# EAGLE design pentalightHD_ctrl (EAGLE 5.11)
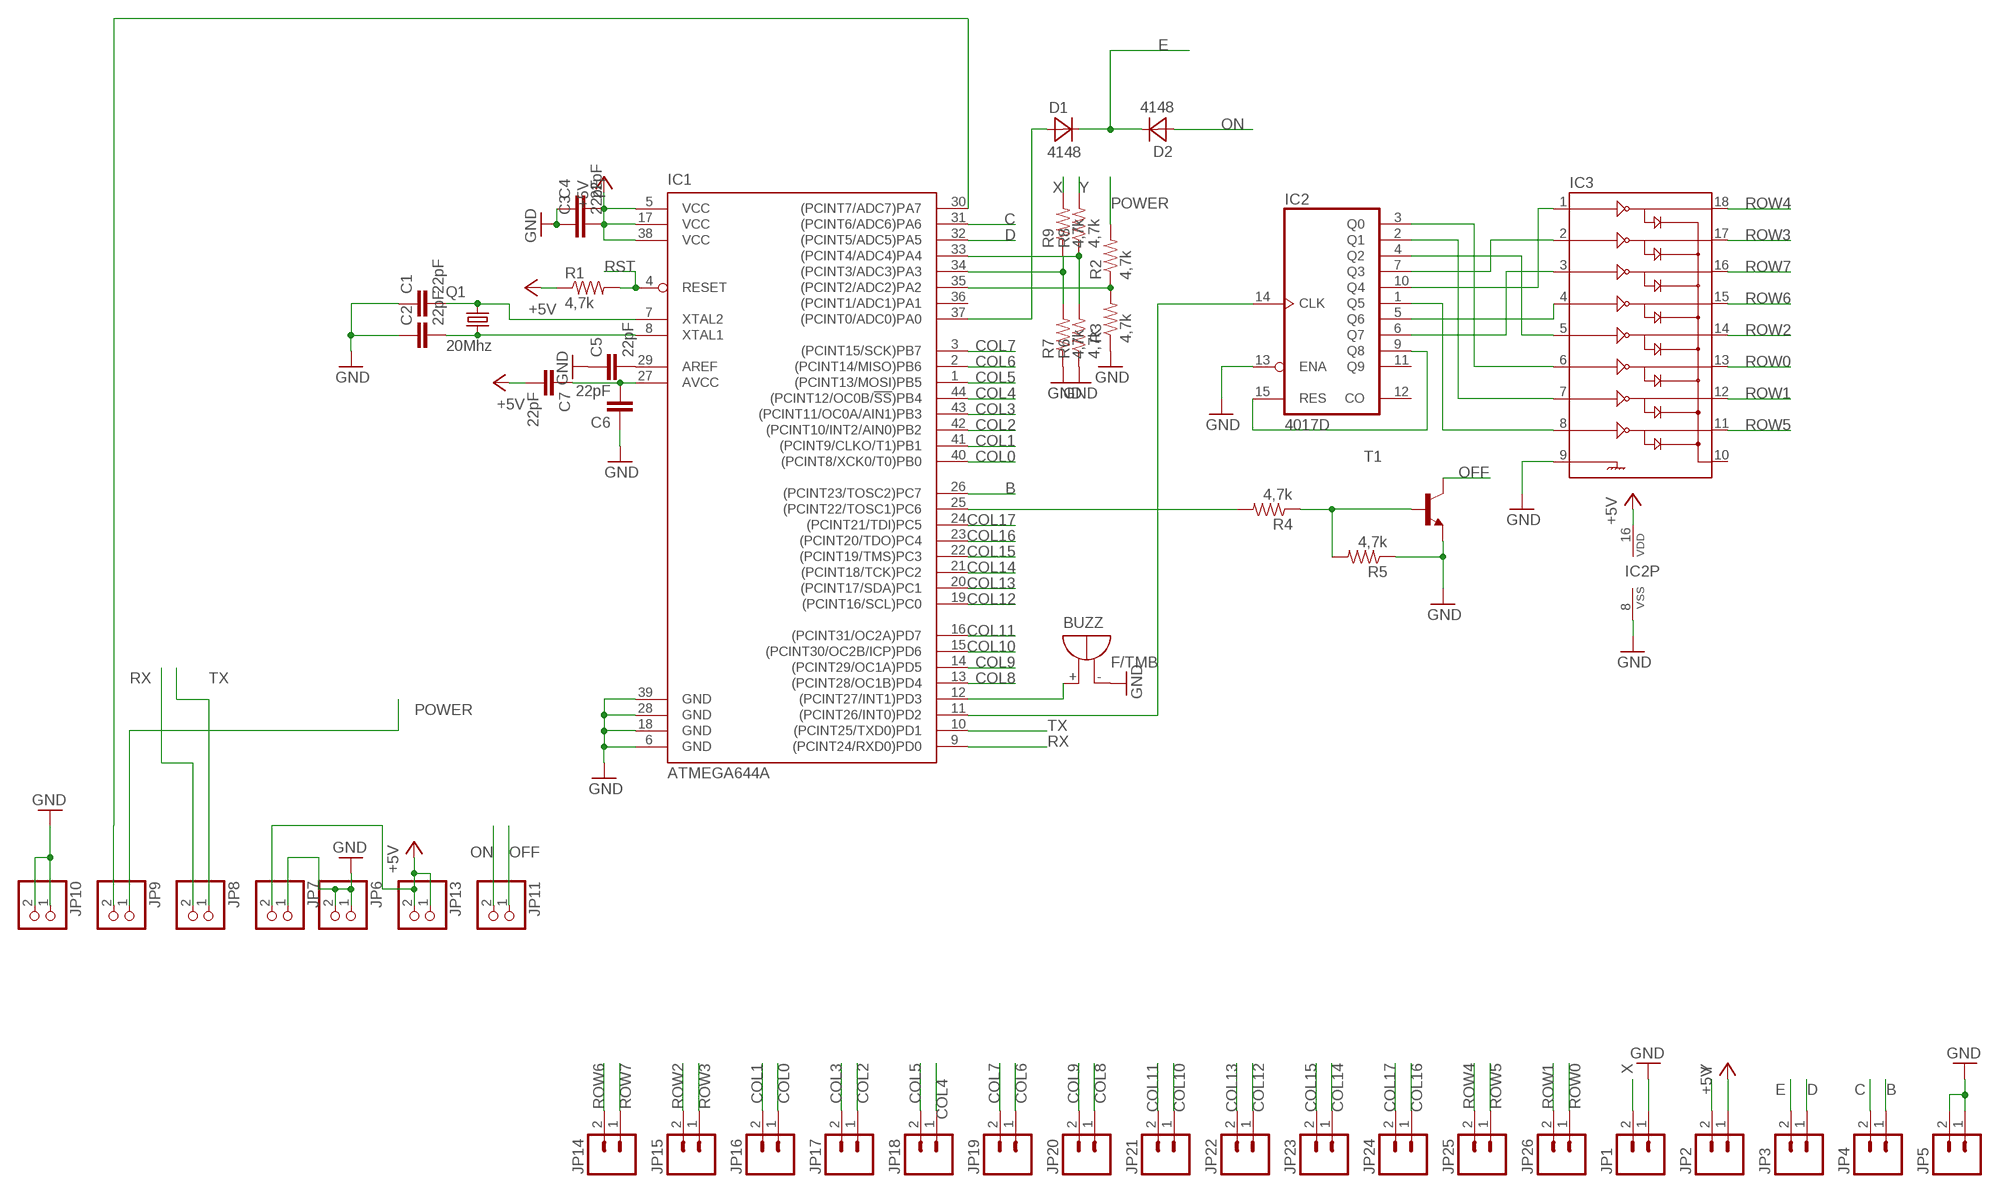
[diagram p0: schematic, sheet 1]

## Parts
BUZZ  F/TMB  [F/TMB]
C1  22pF  CAP0805  [0805]
C2  22pF  CAP0805  [0805]
C3  22pF  CAP0805  [0805]
C4  22pF  CAP0805  [0805]
C5  22pF  CAP0805  [0805]
C6  22pF  CAP0805  [0805]
C7  22pF  CAP0805  [0805]
D1  4148  DIODE_0805  [DIODE_0805]
D2  4148  DIODE_0805  [DIODE_0805]
IC1  ATMEGA644A  [TQFP44]
IC2  4017D  [SO16]
IC3  ULN2803SOIC  [SO018]
JP1  M02PTH  [1X02]
JP2  M02PTH  [1X02]
JP3  M02PTH  [1X02]
JP4  M02PTH  [1X02]
JP5  M02PTH  [1X02]
JP6  PINHD-1X02_2.54-SMD  [1X02SMD]
JP7  PINHD-1X02_2.54-SMD  [1X02SMD]
JP8  PINHD-1X02_2.54-SMD  [1X02SMD]
JP9  PINHD-1X02_2.54-SMD  [1X02SMD]
JP10  PINHD-1X02_2.54-SMD  [1X02SMD]
JP11  PINHD-1X02_2.54-SMD  [1X02SMD]
JP13  PINHD-1X02_2.54-SMD  [1X02SMD]
JP14  M02PTH  [1X02]
JP15  M02PTH  [1X02]
JP16  M02PTH  [1X02]
JP17  M02PTH  [1X02]
JP18  M02PTH  [1X02]
JP19  M02PTH  [1X02]
JP20  M02PTH  [1X02]
JP21  M02PTH  [1X02]
JP22  M02PTH  [1X02]
JP23  M02PTH  [1X02]
JP24  M02PTH  [1X02]
JP25  M02PTH  [1X02]
JP26  M02PTH  [1X02]
Q1  20Mhz  X22-OSCILLATOR  [X22]
R1  4,7k  RESISTOR  [0805]
R2  4,7k  RESISTOR  [0805]
R3  4,7k  RESISTOR  [0805]
R4  4,7k  RESISTOR  [0805]
R5  4,7k  RESISTOR  [0805]
R6  4,7k  RESISTOR  [0805]
R7  4,7k  RESISTOR  [0805]
R8  4,7k  RESISTOR  [0805]
R9  4,7k  RESISTOR  [0805]
T1  -NPN-SOT23-EBC  [SOT23-EBC]

## Nets
+5V: C3.2 C4.2 C7.2 IC1.5(VCC) IC1.17(VCC) IC1.38(VCC) IC2.16(VDD) JP2.1 JP7.2 JP13.1 JP13.2 R1.1
B: IC1.26((PCINT23/TOSC2)PC7) JP4.1
C: IC1.31((PCINT6/ADC6)PA6) JP4.2
COL0: IC1.40((PCINT8/XCK0/T0)PB0) JP16.1
COL1: IC1.41((PCINT9/CLKO/T1)PB1) JP16.2
COL2: IC1.42((PCINT10/INT2/AIN0)PB2) JP17.1
COL3: IC1.43((PCINT11/OC0A/AIN1)PB3) JP17.2
COL4: IC1.44((PCINT12/OC0B/!SS!)PB4) JP18.1
COL5: IC1.1((PCINT13/MOSI)PB5) JP18.2
COL6: IC1.2((PCINT14/MISO)PB6) JP19.1
COL7: IC1.3((PCINT15/SCK)PB7) JP19.2
COL8: IC1.13((PCINT28/OC1B)PD4) JP20.1
COL9: IC1.14((PCINT29/OC1A)PD5) JP20.2
COL10: IC1.15((PCINT30/OC2B/ICP)PD6) JP21.1
COL11: IC1.16((PCINT31/OC2A)PD7) JP21.2
COL12: IC1.19((PCINT16/SCL)PC0) JP22.1
COL13: IC1.20((PCINT17/SDA)PC1) JP22.2
COL14: IC1.21((PCINT18/TCK)PC2) JP23.1
COL15: IC1.22((PCINT19/TMS)PC3) JP23.2
COL16: IC1.23((PCINT20/TDO)PC4) JP24.1
COL17: IC1.24((PCINT21/TDI)PC5) JP24.2
D: IC1.32((PCINT5/ADC5)PA5) JP3.1
E: D1.1(C) D2.1(C) JP3.2
GND: BUZZ.- C1.1 C2.1 C3.1 C4.1 C5.1 C6.1 IC1.6(GND) IC1.18(GND) IC1.28(GND) IC1.39(GND) IC2.8(VSS) IC2.13(ENA) IC3.9 JP1.1 JP5.1 JP5.2 JP6.1 JP6.2 JP7.1 JP10.1 JP10.2 R3.1 R5.1 R6.1 R7.1 T1.E
N$1: D1.2(A) IC1.37((PCINT0/ADC0)PA0)
N$2: IC1.25((PCINT22/TOSC1)PC6) R4.2
N$3: C5.2 IC1.29(AREF)
N$4: IC1.30((PCINT7/ADC7)PA7) JP9.2
N$5: IC1.11((PCINT26/INT0)PD2) IC2.14(CLK)
N$6: IC2.9(Q8) IC2.15(RES)
N$7: C2.2 IC1.8(XTAL1) Q1.1
N$8: C1.2 IC1.7(XTAL2) Q1.3
N$9: C6.2 C7.1 IC1.27(AVCC)
N$10: R4.1 R5.2 T1.B
N$11: BUZZ.+ IC1.12((PCINT27/INT1)PD3)
N$14: IC1.33((PCINT4/ADC4)PA4) R6.2 R8.1
N$15: IC1.34((PCINT3/ADC3)PA3) R7.2 R9.1
N$28: IC1.35((PCINT2/ADC2)PA2) R2.1 R3.2
N$56: IC2.1(Q5) IC3.8
N$57: IC2.2(Q1) IC3.7
N$58: IC2.3(Q0) IC3.6
N$59: IC2.4(Q2) IC3.5
N$60: IC2.5(Q6) IC3.4
N$61: IC2.6(Q7) IC3.3
N$62: IC2.7(Q3) IC3.2
N$63: IC2.10(Q4) IC3.1
OFF: JP11.1 T1.C
ON: D2.2(A) JP11.2
POWER: JP9.1 R2.2
ROW0: IC3.13 JP26.1
ROW1: IC3.12 JP26.2
ROW2: IC3.14 JP15.2
ROW3: IC3.17 JP15.1
ROW4: IC3.18 JP25.2
ROW5: IC3.11 JP25.1
ROW6: IC3.15 JP14.2
ROW7: IC3.16 JP14.1
RST: IC1.4(RESET) R1.2
RX: IC1.9((PCINT24/RXD0)PD0) JP8.2
TX: IC1.10((PCINT25/TXD0)PD1) JP8.1
X: JP1.2 R9.2
Y: JP2.2 R8.2
Unconnected: IC1.36((PCINT1/ADC1)PA1) IC2.11(Q9) IC2.12(CO) IC3.10

## Library data of the parts
BUZZ = buzzer:F/TMB: BUZZER Source: Buerklin
C1-C7 = SparkFun:CAP: Capacitor Standard 0603 ceramic capacitor, and 0.1" leaded capacitor.
D1 D2 = seb:DIODE_0805
IC1 = atmel:ATMEGA644: 8-bit Microcontroller with 64K Bytes In-System Programmable Flash Source: http://www.atmel.com/dyn/resources/prod_documents/doc2593.pdf; MPN: ATMEGA644PV-10AU; OC_FARNELL: 1455123; OC_NEWARK: 58M3748
IC2 = 40xx:4017: COUNTER/DIVIDER
IC3 = SparkFun:ULN2803: Darlington Driver ULN2803 Darlington array. 500mA max per channel, 8-channel package. Spark Fun Electronics SKU : COM-00312
JP1-JP5 JP14-JP26 = SparkFun:M02: Header 2 Standard 2-pin 0.1" header. Use with straight break away headers (SKU : PRT-00116), right angle break away headers (PRT-00553), swiss pins (PRT-00743), machine pins (PRT-00117), and female headers (PRT-00115). Molex polarized connector foot print use with SKU : PRT-08233 with associated crimp pins and housings.
JP6-JP11 JP13 = pinhead-2:PINHD-1X02: PIN HEADER
Q1 = seb:X22-OSCILLATOR
R1-R9 = SparkFun:RESISTOR: Resistor Basic schematic elements and footprints for 0603, 1206, and PTH 1/10th watt (small) resistors.
T1 = transistor:*-NPN-: NPN Transistror BF959 corrected 2008.03.06

## Board
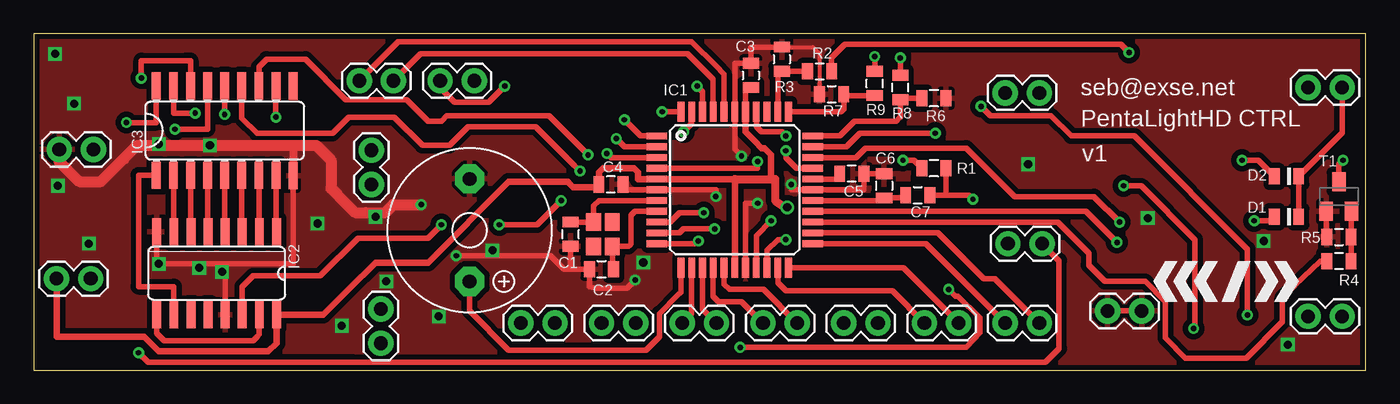
[diagram p1: board, top side]
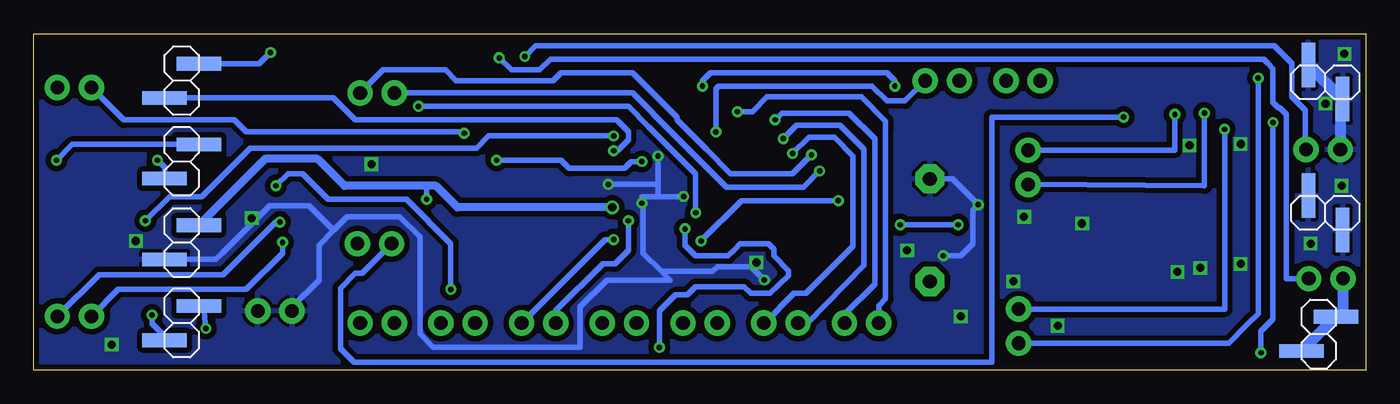
[diagram p2: board, bottom side, seen from below]

Size 99 x 25 mm. Coordinates in mm from the lower left corner, seen from the top.
Outline: 99,25 0,25 0,0 99,0 99,25
Copper layers (1+2*3+16): Top 0.035mm / dielectric 1.5mm / Route2 0.035mm / dielectric 0.15mm / Route3 0.035mm / dielectric 0.2mm / Bottom 0.035mm
Design rules "default *": minimum track width 10mil, minimum drill 0.4mm, track to track 8mil, track to pad 8mil, pad to pad 8mil, via to via 8mil, smd to smd 8mil, copper to edge 15mil, drill to drill 8mil, minimum pad ring 10mil, minimum via ring 8mil, stop-mask expansion 4mil, vias tented up to drill 190mil, thermal gap 10mil

### Footprints (pad centres in the part's own frame; a part is rotated, then mirrored left to right if it is on the bottom)
F/TMB = drill 1.016 pad 2.159 octagon: + 3.81,0; - -3.81,0
0805 = smd 0.8 x 1.2: 1 -0.9,0; 2 0.9,0
DIODE_0805 = smd 0.8 x 1.2: 1 -0.9,0; 2 0.9,0
TQFP44 = smd 1.5 x 0.5: 1 -5.8,4; 2 -5.8,3.2; 3 -5.8,2.4; 4 -5.8,1.6; 5 -5.8,0.8; 6 -5.8,0; 7 -5.8,-0.8; 8 -5.8,-1.6; 9 -5.8,-2.4; 10 -5.8,-3.2; 11 -5.8,-4; 23 5.8,-4; 24 5.8,-3.2; 25 5.8,-2.4; 26 5.8,-1.6; 27 5.8,-0.8; 28 5.8,0; 29 5.8,0.8; 30 5.8,1.6; 31 5.8,2.4; 32 5.8,3.2; 33 5.8,4 | smd 0.5 x 1.5: 12 -4,-5.8; 13 -3.2,-5.8; 14 -2.4,-5.8; 15 -1.6,-5.8; 16 -0.8,-5.8; 17 0,-5.8; 18 0.8,-5.8; 19 1.6,-5.8; 20 2.4,-5.8; 21 3.2,-5.8; 22 4,-5.8; 34 4,5.8; 35 3.2,5.8; 36 2.4,5.8; 37 1.6,5.8; 38 0.8,5.8; 39 0,5.8; 40 -0.8,5.8; 41 -1.6,5.8; 42 -2.4,5.8; 43 -3.2,5.8; 44 -4,5.8
SO16 = smd 0.66 x 2.032: 1 -4.445,-3.073; 2 -3.175,-3.073; 3 -1.905,-3.073; 4 -0.635,-3.073; 5 0.635,-3.073; 6 1.905,-3.073; 7 3.175,-3.073; 8 4.445,-3.073; 9 4.445,3.073; 10 3.175,3.073; 11 1.905,3.073; 12 0.635,3.073; 13 -0.635,3.073; 14 -1.905,3.073; 15 -3.175,3.073; 16 -4.445,3.073
SO018 = smd 0.66 x 2.032: 1 -5.08,-3.315; 2 -3.81,-3.315; 3 -2.54,-3.315; 4 -1.27,-3.315; 5 0,-3.315; 6 1.27,-3.315; 7 2.54,-3.315; 8 3.81,-3.315; 9 5.08,-3.353; 10 5.08,3.315; 11 3.81,3.315; 12 2.54,3.315; 13 1.27,3.315; 14 0,3.315; 15 -1.27,3.315; 16 -2.54,3.315; 17 -3.81,3.315; 18 -5.08,3.315
1X02 = drill 1.016 pad 1.88 round: 1 0,0; 2 2.54,0
1X02SMD = smd 1.016 x 3.302: 1 -1.27,1.27; 2 1.27,-1.27
X22 = smd 1.3 x 1.1: 1 0.9,0.7; 2 -0.9,0.7; 3 -0.9,-0.7; 4 0.9,-0.7
SOT23-EBC = smd 1 x 1.4: B 0.95,-1.1; C 0,1.1; E -0.95,-1.1

### Placement (x,y rotation side)
BUZZ  32.4,10.4 270 top
C1  39.9,10.1 90 top
C2  42.2,7.5 0 top
C3  53.3,21.9 270 top
C4  42.9,13.8 180 top
C5  60.8,14.6 180 top
C6  63.2,13.7 270 top
C7  65.7,13 0 top
D1  93.1,11.4 180 top
D2  93.1,14.4 180 top
IC1  52.1,13.4 0 top
IC2  13.6,7.2 180 top
IC3  14.2,17.8 0 top
JP1  1.9,16.4 0 top
JP2  1.7,6.8 0 top
JP3  94.7,21 0 top
JP4  94.7,4 0 top
JP5  79.8,4.4 0 top
JP6  3,21.4 180 bottom
JP7  88,9.5 90 bottom
JP8  88,3.5 270 bottom
JP9  88,21.5 270 bottom
JP10  3,11.7 180 bottom
JP11  88,15.5 270 bottom
JP13  3.5,2.7 90 bottom
JP14  25.8,2 90 top
JP15  25.1,13.8 90 top
JP16  24.2,21.5 0 top
JP17  30.2,21.5 0 top
JP18  36.2,3.5 0 top
JP19  42.2,3.5 0 top
JP20  48.2,3.5 0 top
JP21  54.2,3.5 0 top
JP22  60.2,3.5 0 top
JP23  66.2,3.5 0 top
JP24  72.2,3.5 0 top
JP25  72.4,9.4 0 top
JP26  72.2,20.6 0 top
Q1  42.3,10.1 270 top
R1  66.9,15 180 top
R2  58.4,22.2 0 top
R3  55.6,23.1 270 top
R4  97,8.1 180 top
R5  97,9.9 0 top
R6  66.9,20.2 180 top
R7  59.3,20.5 0 top
R8  64.4,21 90 top
R9  62.5,21.3 90 top
T1  97,12.9 0 top

### Tracks (layer width: path | path; a pad name or v marks a point on that pad's centre or on a via)
+5V  (via drill 0.4, 0.6)
  Top 0.406: 54.8,14.2 55.1,14.2 | 67.8,13 C7.2 | 67.8,13 67.8,13.6 R1.1 | 55.8,12.1 v56,12.1 | 42,13.6 C4.2 | v69.8,12.7 69.5,13 67.8,13 | IC1.38 52.9,21 C3.2
  Top 0.5: IC1.17 52.1,14.2 IC1.5 44.9,14.2 44.9,14.7 44.6,15 42.3,15 42,14.7 C4.2 | IC1.38 52.9,17.9 52.9,17.7 53.6,17 54.1,16.5 54.3,16.5 54.8,16 54.8,14.8 54.8,14.2 | JP2.1 1.7,2.5 8.2,2.5 9.3,1.4 17.45,1.4 18.05,2 IC2.16 21.53,4.13 23.4,6 25.4,8 29.3,8 35.3,14 39.7,14 39.8,13.9 40.1,13.6 42,13.6
  Top 0.61: 52.1,14.2 54.8,14.2 | 54.8,14.2 55.1,14.2 | 54.8,14.2 55.1,14.2 | 55.1,14.2 55.1,12.6 55.8,12.1
  Bottom 0.406: 1.7,4.3 JP13.2 | 69.1,13.7 69.8,13.7 v69.8,12.7
  Bottom 0.61: v56,12.1 67.5,12.1 69.1,13.7 69.8,13.7 75.9,13.7 77.9,15.7 81.8,15.7 82.73,14.77 JP7.2
  Bottom 0.813: JP13.2 JP13.1 | JP2.1 1.7,4.3
B  (via drill 0.4)
  Top 0.406: IC1.26 78.2,11.8 v80.5,9.5
  Bottom 0.406: v80.5,9.5 80.5,8.7 83.2,6 83.6,6 85.6,6 92.7,6 JP4.1
C  (via drill 0.4)
  Top 0.406: IC1.31 61.1,15.8 61.8,16.5 69.3,16.5 72.9,12.9 78.8,12.9 v80.7,11
  Bottom 0.406: v80.7,11 81,11 82.6,9.4 | 82.6,9.4 82.8,9.2 82.6,9.4 | 82.6,9.4 84.9,7.1 86.6,7.1 90.4,7.1 92,7.1 94.14,7.1 JP4.2
COL0
  Top 0.406: JP16.1 27.1,24.4 32,24.4 48.9,24.4 50.7,22.6 51.3,22 IC1.40
COL1
  Top 0.406: JP16.2 28.74,23.5 33.9,23.5 48.6,23.5 49.7,22.4 50.5,21.6 IC1.41
COL2  (via drill 0.4)
  Top 0.406: v35,21.1 33.8,19.9 31.3,19.9 30.2,21 JP17.1 | v49.3,21.1 49.7,20.7 IC1.42
  Bottom 0.406: v49.3,21.1 49.3,21.5 48.7,22.1 35.6,22.1 35,21.5 v35,21.1
COL3  (via drill 0.4)
  Top 0.406: v48.3,17.7 48.9,18.3 IC1.43
  Bottom 0.406: v48.3,17.7 48.3,19.7 48.3,20.9 48.1,21.1 47.6,21.1 45.8,21.1 45.4,21.1 36.7,21.1 35.6,20 34.24,20 JP17.2
COL4  (via drill 0.4)
  Top 0.406: v46.7,19.2 IC1.44
  Bottom 0.406: v46.7,19.2 45.6,19.2 44.5,20.3 37.5,20.3 35.7,18.5 35.7,17.9 35.7,5.3 36.2,4.8 JP18.1
COL5  (via drill 0.4)
  Top 0.406: v43.9,18.6 45.1,17.4 IC1.1
  Bottom 0.406: JP18.2 38.74,4.16 36.5,6.4 36.5,17.2 38.4,19.1 43.4,19.1 v43.9,18.6
COL6  (via drill 0.4)
  Top 0.406: v43.3,17.2 43.9,16.6 IC1.2
  Bottom 0.406: JP19.1 41.5,3.5 37.3,7.8 37.3,16.4 39.1,18.2 42.3,18.2 v43.3,17.2
COL7  (via drill 0.4)
  Top 0.406: IC1.3 42.9,15.8 v42.6,16.1
  Bottom 0.406: JP19.2 44.7,3.5 42.5,5.7 41.6,5.7 38.1,9.2 38.1,15.9 39.5,17.3 41.4,17.3 v42.6,16.1
COL8
  Top 0.406: IC1.13 48.9,4.2 JP20.1
COL9
  Top 0.406: JP20.2 49.7,4.54 IC1.14
COL10
  Top 0.406: JP21.1 52.6,5.1 50.9,5.1 50.5,5.5 IC1.15
COL11
  Top 0.406: JP21.2 54.24,6 51.7,6 51.3,6.4 IC1.16
COL12  (via drill 0.4)
  Top 0.406: IC1.19 53.7,10 v54.8,11.1
  Bottom 0.406: v54.8,11.1 54.8,8.9 55.8,7.9 56.7,7.9 60.2,4.4 JP22.1
COL13  (via drill 0.4)
  Top 0.406: IC1.20 54.5,8.9 55.3,9.7 v55.9,9.7
  Bottom 0.406: v55.9,9.7 56.54,9.7 JP22.2
COL14
  Top 0.406: IC1.21 55.3,6.5 55.9,5.9 63.8,5.9 JP23.1
COL15
  Top 0.406: IC1.22 64.64,7.6 JP23.2
COL16
  Top 0.406: IC1.23 66.3,9.4 JP24.1
COL17
  Top 0.406: IC1.24 67.2,10.2 70.6,6.8 71.44,6.8 JP24.2
D  (via drill 0.4)
  Top 0.406: IC1.32 60.4,16.6 61.4,17.6 62.4,17.6 64.1,17.6 64.9,17.6 v67,17.6
  Bottom 0.406: 94.7,21.4 JP3.1 92.3,18.6 84.1,18.6 83.2,17.7 80.1,17.7 79.9,17.7 67.2,17.7 v67,17.6
E
  Top 0.406: D1.1 D2.1 97.24,17.64 JP3.2
GND  (via drill 0.4, 0.6)
  Top 0.305: R7.1 58.4,23.5 57.9,24 R3.1
  Top 0.406: v52.6,15.9 52.1,16.4 IC1.39 52.1,22.8 C3.1 53.3,24 R3.1 | v50.7,12.9 50.7,13.4 IC1.6 43.8,13.4 C4.1 | IC1.18 52.9,12.4 v53.8,12.4 | 39.9,7.5 C1.1 39.9,7.5 | 39.9,7.5 39.4,7.5 38.4,8.5 v31.4,8.5 | v56.3,13.8 56.3,13.4 IC1.28 61.7,13.4 C5.1 C6.1 | IC2.8 9.15,7.9 13.8,7.9 14.23,7.9 | 14.23,7.9 IC2.13 | IC3.9 19.28,7.9 14.23,7.9 | v44.7,6.7 44.1,6.1 41.8,6.1 41.3,6.2 C2.1 39.9,7.5 | JP5.1 JP5.2 | R5.1 96.05,9.85 T1.E
  Top 0.61: IC3.9 19.28,16.7 18.7,16.7
  Top 0.813: JP1.1 1.9,15.5 3.4,14 5,14 6.7,15.7 7.7,16.7 12.4,16.7 18.7,16.7 19.7,16.7 21,16.7 22.1,15.6 22.1,13.5 23.2,12.4 23.9,11.7 24.7,11.7 26.1,11.7 26.7,12.3 v28.8,12.3
  Bottom 0.406: 52.6,12.9 52.6,13.4 | 52.6,13.4 52.6,13.8 | 52.6,13.8 v52.6,15.9 | 52.6,12.9 v50.7,12.9 | 52.6,12.9 53.8,12.9 v53.8,12.4 53.7,12.3 53.7,8.7 52.35,7.35 | 52.6,13.8 v56.3,13.8 | 52.6,13.4 52.6,13.8 | v31.4,8.5 30.1,8.5 29.2,9.4 29.2,11.7 29.2,11.9 v28.8,12.3 30.71,14.21 BUZZ.- | 52.35,7.35 51.7,6.7 56.4,6.7 58.4,4.7 58.4,4.5 58.4,4.3 58.4,1.7 69.3,1.7 70.3,2.7 70.3,9.9 71.8,11.4 75.7,11.4 76.7,10.4 | JP5.1 79.8,4.7 77.8,6.7 77.8,9.3 76.7,10.4 | v44.7,6.7 45.7,7.7 48.2,7.7 48.55,7.35 52.35,7.35 | 76.7,10.4 78.53,12.23 81.47,12.23 85,8.7 85.47,8.23 JP7.1
  Bottom 0.813: JP1.1 1.9,19.76 JP6.1 JP6.2
  other vias: 82.8,11.3 73.9,15.3 45.3,8 30.1,4 34.1,8.9 26.2,6.6 25.4,11.4 21.1,10.9 22.9,3.3 14,7.3 12.3,7.6 9.3,7.9 13.1,16.7 9.3,16.8 4.1,9.4 1.8,13.7 3,19.8 1.6,23.5 93.2,1.9 91.4,9.6
  pour Bottom (isolate 0.4): 0,25.2 99,25.2 99,0 0,0
  pour Top (isolate 0.4): 0,25.2 99,25.2 99,0 0,0
N$1  (via drill 0.4)
  Top 0.406: IC1.37 53.7,18.1 54.1,17.7 55.6,17.7 v55.9,17.4 | v90.7,11.1 91.9,11.1 D1.2
  Bottom 0.406: v55.9,17.4 65.2,17.4 66.1,16.5 82.9,16.5 86.5,12.9 88.9,12.9 v90.7,11.1
N$2
  Top 0.406: IC1.25 76.1,11 78.4,8.7 78.4,7.8 79.6,6.6 82.6,6.6 84.1,5.1 84.1,2.4 85.6,0.9 90.1,0.9 92.8,3.6 92.8,5.4 93.7,6.3 95.6,8.1 R4.2
N$3
  Top 0.406: IC1.29 59.9,14.2 C5.2
N$4  (via drill 0.4)
  Top 0.406: IC1.30 56.7,15 55.9,15.8 v55.9,16.3
  Bottom 0.406: v55.9,16.3 55.6,16.3 55,16.9 54.8,17.1 54.8,17.7 55.7,18.6 67.4,18.6 67.5,18.6 75.1,18.6 75.4,18.9 76.73,20.23 JP9.2
N$5  (via drill 0.4)
  Top 0.406: 38.91,12.3 v39.2,12.6 37.4,10.8 v34.6,10.8 | v49.4,9.6 49.1,9.4 IC1.11 | IC2.14 15.5,6.21 16.3,7 21.3,7 24.1,9.8 29.3,9.8 v30.3,10.8
  Bottom 0.406: v39.2,12.6 46.4,12.6 v49.4,9.6 | v30.3,10.8 30.8,10.8 v34.6,10.8
N$6
  Top 0.406: IC2.9 9.15,2.75 9.7,2.2 16.3,2.2 16.6,2.5 16.77,2.67 IC2.15
N$7
  Top 0.406: IC1.8 44.7,11.8 44.4,11.5 44.4,9.4 44.3,9.3 44.2,9.2 Q1.1 43,7.6 C2.2
N$8
  Top 0.406: IC1.7 42,12.6 41.6,12.2 Q1.3 C1.2
N$9
  Top 0.406: IC1.27 63.2,12.6 C6.2 64.8,12.8 C7.1
N$10
  Top 0.406: R4.1 R5.2 97.9,11.15 T1.B
N$11
  Top 0.406: BUZZ.+ 32.4,4.4 35.3,1.5 45.5,1.5 46.5,2.5 46.5,4.2 47.9,5.6 48.1,5.8 IC1.12
N$14
  Top 0.406: IC1.33 59.9,17.4 61,18.5 64.1,18.5 64.3,18.7 64.4,18.8 R8.1 64.5,20.2 R6.2
N$15
  Top 0.406: IC1.34 60,19.2 60.1,19.3 60.2,19.4 R7.2 60.3,20.4 R9.1
N$28
  Top 0.406: IC1.35 55.3,21.9 R3.2 R2.1
N$56
  Top 0.406: IC2.1 18.01,10.27 IC3.8
N$57
  Top 0.406: IC2.2 16.74,10.27 IC3.7
N$58
  Top 0.406: IC2.3 15.5,10.8 15.47,10.8 IC3.6
N$59
  Top 0.406: IC2.4 14.2,10.27 IC3.5
N$60
  Top 0.406: IC2.5 12.93,10.27 IC3.4
N$61
  Top 0.406: IC2.6 11.66,10.27 IC3.3
N$62
  Top 0.406: IC2.7 10.39,10.27 IC3.2
N$63
  Top 0.406: IC3.1 7.8,14.48 7.8,6.2 10.43,6.2 IC2.10
OFF  (via drill 0.4)
  Top 0.406: T1.C 97,15.3 v97.3,15.6
  Bottom 0.406: v97.3,15.6 96.13,16.77 JP11.1
ON  (via drill 0.4)
  Top 0.406: v89.8,15.6 91,15.6 D2.2
  Bottom 0.406: JP11.2 89.27,15.07 v89.8,15.6
POWER  (via drill 0.4)
  Top 0.406: R2.2 59.3,23.2 60.3,24.2 80.8,24.2 v81.4,23.6
  Bottom 0.406: v81.4,23.6 82.23,22.77 JP9.1
ROW0  (via drill 0.4)
  Top 0.406: v40.6,14.8 40.2,15.2 37.3,18.1 32.3,18.1 30.9,16.7 28.9,16.7 26.8,18.8 23.4,18.8 22.2,17.6 16.6,17.6 15.47,18.73 IC3.13
  Bottom 0.406: JP26.1 70.2,20.6 54.5,20.6 51.4,17.5 47.5,13.6 41.8,13.6 v40.6,14.8
ROW1  (via drill 0.4)
  Top 0.406: v41.2,16 41,16.2 38.3,18.9 30.7,18.9 30.3,18.5 29.3,18.5 27.7,20.1 23.2,20.1 20.2,23.1 17.3,23.1 16.74,22.54 IC3.12
  Bottom 0.406: JP26.2 73.24,22.1 73.04,22.3 68.4,22.3 67.6,21.5 60.4,21.5 59.8,22.1 54.5,22.1 51.2,18.8 51.2,18.6 49,16.4 47.2,14.6 42.6,14.6 v41.2,16
ROW2  (via drill 0.4)
  Top 0.406: v14.2,19 IC3.14
  Bottom 0.406: JP15.2 14.2,16.34 v14.2,19
ROW3  (via drill 0.4)
  Top 0.406: v12,19.1 10.39,19.1 IC3.17
  Bottom 0.406: JP15.1 12,13.7 v12,19.1
ROW4  (via drill 0.4)
  Top 0.406: JP25.2 76.2,8.14 76.2,1.6 75.2,0.6 23.7,0.6 8.5,0.6 v7.8,1.3 | v6.9,18.4 9.12,18.4 IC3.18
  Bottom 0.406: v7.8,1.3 7.8,2.9 7.3,3.4 6.9,3.8 v6.9,18.4
ROW5  (via drill 0.4)
  Top 0.406: v18,18.8 IC3.11
  Bottom 0.406: JP25.1 74.6,7.2 75.1,7.2 76.2,6.1 76.2,1.6 75.2,0.6 27.8,0.6 27.8,1.2 27.8,18.8 v18,18.8
ROW6  (via drill 0.4)
  Top 0.406: v10.5,17.9 12.93,17.9 IC3.15
  Bottom 0.406: JP14.2 10.5,4.54 v10.5,17.9
ROW7  (via drill 0.4)
  Top 0.406: v8,21.7 8,23 11.3,23 11.66,23 IC3.16
  Bottom 0.406: JP14.1 10.2,2 8.8,3.4 8,4.2 v8,21.7
RST  (via drill 0.4)
  Top 0.406: IC1.4 49.5,15 53.8,15 v53.8,15.5 | v64.6,15.6 65.4,15.6 R1.2
  Bottom 0.406: v64.6,15.6 59.8,15.6 59.2,15 55.1,15 54.6,15.5 v53.8,15.5
RX  (via drill 0.4)
  Top 0.406: IC1.9 47.3,11 48,11.7 v49.8,11.7 | v70.4,19.6 71.1,18.9 75.6,18.9 77.1,17.4 81.8,17.4 90.2,9 90.2,5.3 v90.2,4.1
  Bottom 0.406: v49.8,11.7 49.8,14.6 53.3,18.1 54.8,19.6 v70.4,19.6 | v90.2,4.1 90.2,3.46 89.27,2.53 JP8.2
TX  (via drill 0.4)
  Top 0.406: IC1.10 48,10.2 48.3,10.5 v50.6,10.5 | v52.5,1.7 69.3,1.7 70.3,2.8 70.3,3.9 68.7,5.5 68.5,5.5 v68,6 | v81,13.7 82.3,13.7 86.3,9.7 86.3,3.3 v86.2,3.1
  Bottom 0.406: v50.6,10.5 50.6,9.3 49.8,8.5 47.4,8.5 46.9,9 46.5,9.4 44.4,9.4 44,9 44,8.5 42.9,7.4 42.9,7 44.3,5.7 45.3,5.7 45.7,5.7 46.2,6.2 49.8,6.2 50.4,5.6 50.96,5.6 51.3,5.6 52.4,4.5 52.5,4.4 52.5,2.6 v52.5,1.7 | v68,6 68,9.4 71.3,12.7 77.1,12.7 79,14.6 80.1,14.6 v81,13.7 | v86.2,3.1 86.37,4.77 JP8.1
X  (via drill 0.4)
  Top 0.406: v62.5,23.3 R9.2
  Bottom 0.406: JP1.2 4.5,16.4 4.5,17 4.5,19.3 5.5,20.3 5.5,22.8 6.8,24.1 20.9,24.1 30.3,24.1 30.6,24.1 57.8,24.1 61.7,24.1 v62.5,23.3
Y  (via drill 0.4)
  Top 0.406: v64.4,23.2 R8.2
  Bottom 0.406: JP2.2 5.9,6.8 5.9,18 5.9,19 6.4,19.5 6.5,19.5 6.9,19.9 6.9,22.4 7.3,22.8 7.6,23.1 20.9,23.1 30.5,23.1 31.1,23.1 56.5,23.1 57.1,23.1 60.6,23.1 61.4,22.3 63.5,22.3 v64.4,23.2

### Text on the board
tPlace: seb@exse.net | PentaLightHD CTRL | v1
tDocu: www.C3D2.de